# EAGLE design nano19 (EAGLE 9.5.1)
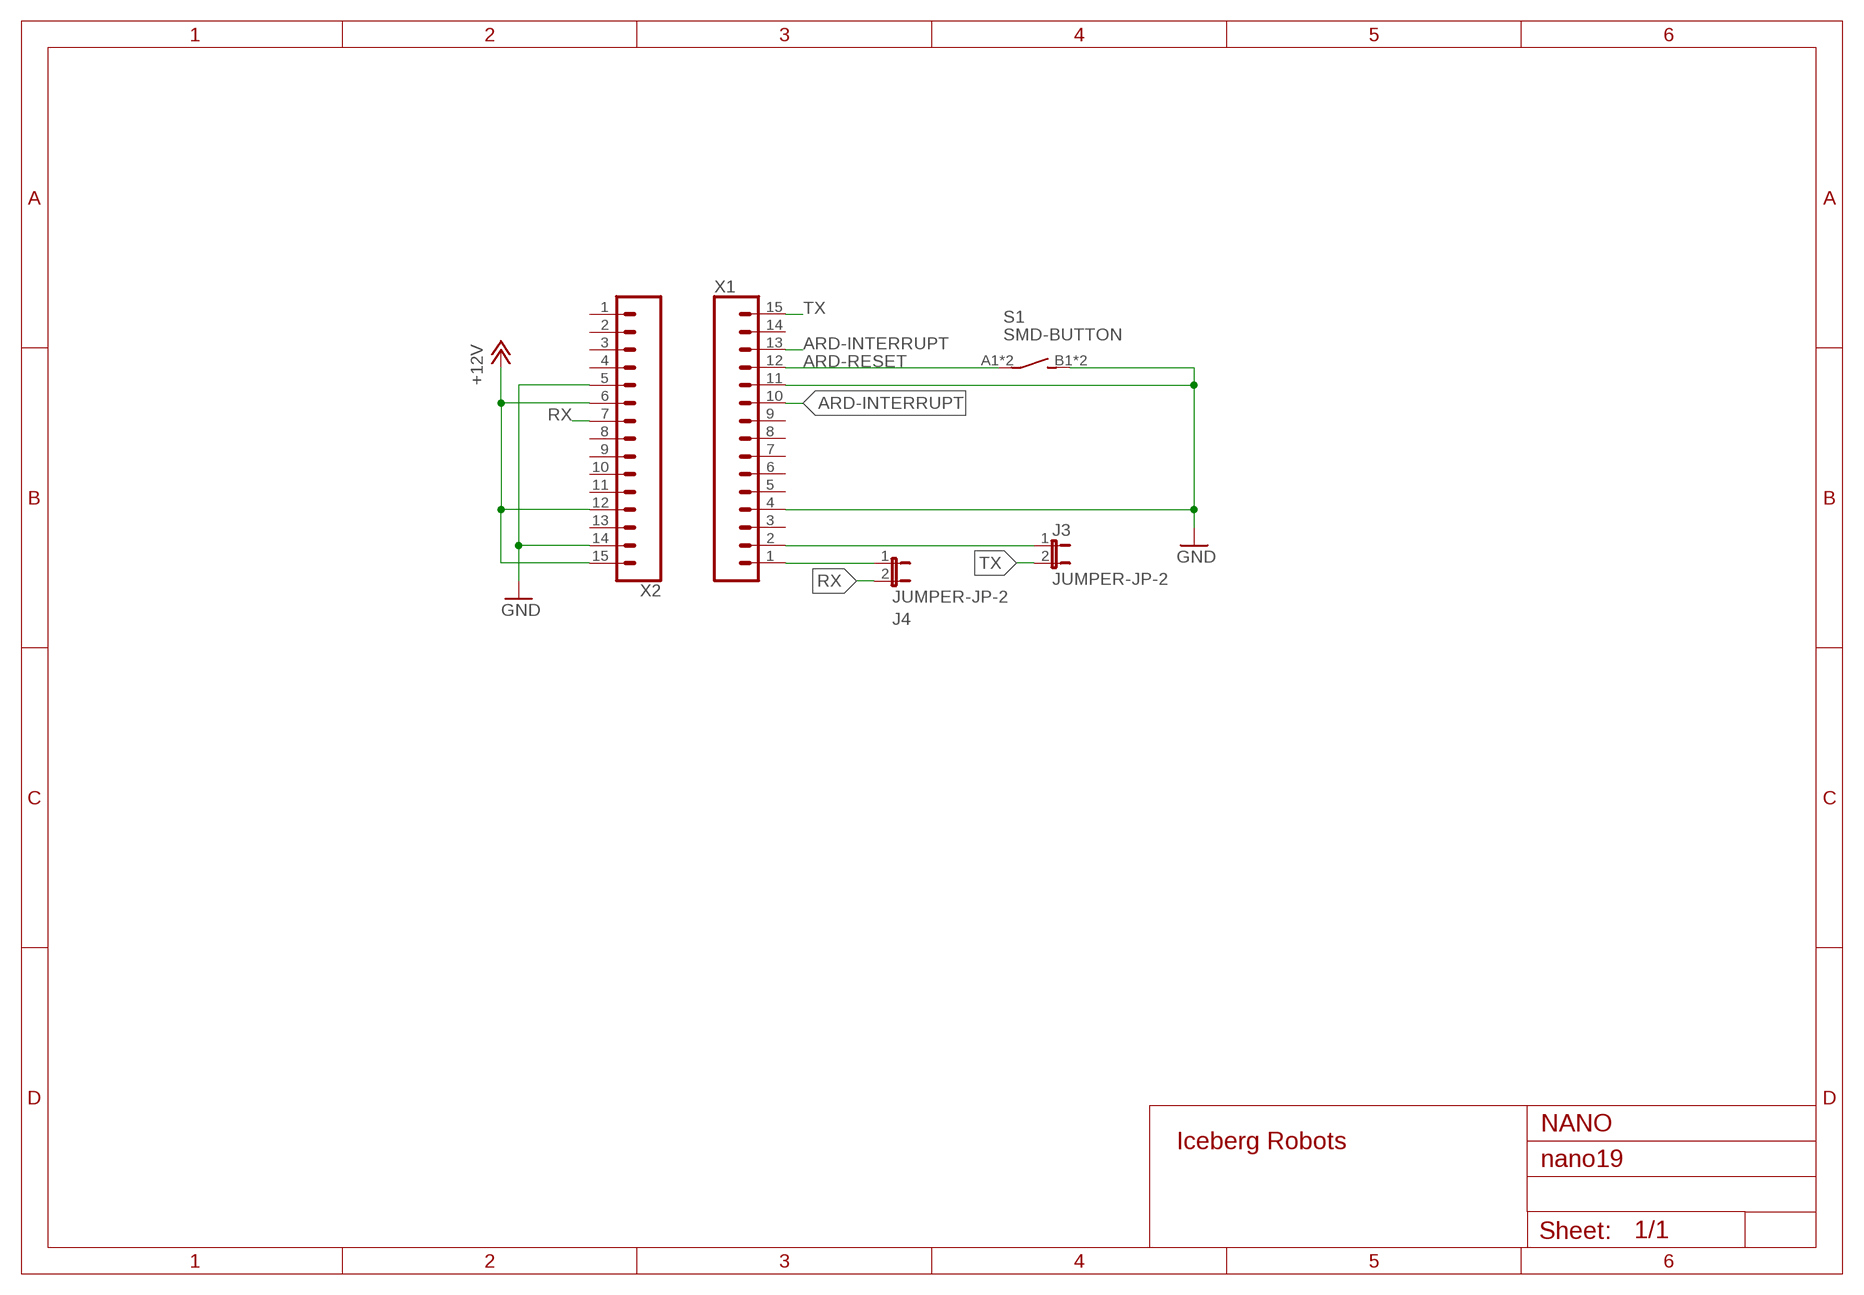
[diagram p0: schematic, sheet 1]

## Parts
J3  JUMPER-JP-2  [JUMPER_JP1]
J4  JUMPER-JP-2  [JUMPER_JP1]
S1  SMD-BUTTON  [SWITCH-6MM-SMD]
X1  CONN_15  [1X15]
X2  CONN_15  [1X15]

## Nets
+12V: X2.6 X2.12 X2.15
ARD-INTERRUPT: X1.10 X1.13
ARD-RESET: S1.A1(P) S1.A2(P) X1.12
GND: S1.B1(S) S1.B2(S) X1.4 X1.11 X2.5 X2.14
N$1: J3.1 X1.2
N$2: J4.1 X1.1
RX: J4.2 X2.7
TX: J3.2 X1.15
Unconnected: X1.3 X1.5 X1.6 X1.7 X1.8 X1.9 X1.14 X2.1 X2.2 X2.3 X2.4 X2.8 X2.9 X2.10 X2.11 X2.13

## Notes on the sheet
- NANO

## Library data of the parts
J3 J4 = iceberg20:JUMPER-JP-2: Datenblatt: Link
S1 = iceberg20:SMD-BUTTON: SMD-Button, 6mm x 6mm Datenblatt: Link <https://www.buerklin.com/medias/sys_master/root/h03/h3f/8877444497438/8877444497438.pdf>; BESTAND: 0; HERSTELLER: Alcoswitch; HERSTELLER-NR: 4-1437565-1 FSM4JSMA; SUPPLIER: Bürklin; SUPPLIER-NR: 12G482
X1 X2 = SparkFun-Connectors:CONN_15: Multi connection point. Often used as Generic Header-pin footprint for 0.1 inch spaced/style header connections On any of the 0.1 inch spaced packages, you can populate with these: Break Away Headers - Straight <https://www.sparkfun.com/products/116> (PRT-00116) Break Away Male Headers - Right Angle <https://www.sparkfun.com/products/553> (PRT-00553) Female Headers <https://www.sparkfun.com/products/115> (PRT-00115) Break Away Headers - Machine Pin <https://www.sparkfun.com/products/117> (PRT-00117) Break Away Female Headers - Swiss Machine Pin <https://www.sparkfun.com/products/743> (PRT-00743) For SCREWTERMINALS and SPRING TERMINALS visit here: Screw Terimnals on SparkFun.com <https://www.sparkfun.com/search/results?term=Screw+Terminals> (5mm/3.5mm/2.54mm spacing) This device is also useful as a general connection point to wire up your design to another part of your project. Our various solder wires solder well into these plated through hole pads. Hook-Up Wire - Assortment (Stranded, 22 AWG) <https://www.sparkfun.com/products/11375> (PRT-11375) Hook-Up Wire - Assortment (Solid Core, 22 AWG) <https://www.sparkfun.com/products/11367> (PRT-11367) View the entire wire category on our website here <https://www.sparkfun.com/categories/141> Special notes: Molex polarized connector foot print use with SKU : PRT-08231 with associated crimp pins and housings. 1MM SMD Version SKU: PRT-10208 NOTES ON THE VARIANTS LOCK and LOCK_LONGPADS... This footprint was designed to help hold the alignment of a through-hole component (i.e. 6-pin header) while soldering it into place. You may notice that each hole has been shifted either up or down by 0.005 of an inch from it's more standard position (which is a perfectly straight line). This slight alteration caused the pins (the squares in the middle) to touch the edges of the holes. Because they are alternating, it causes a "brace" to hold the component in place. 0.005 has proven to be the perfect amount of "off-center" position when using our standard breakaway headers. Although looks a little odd when you look at the bare footprint, once you have a header in there, the alteration is very hard to notice. Also,if you push a header all the way into place, it is covered up entirely on the bottom side.

## Board
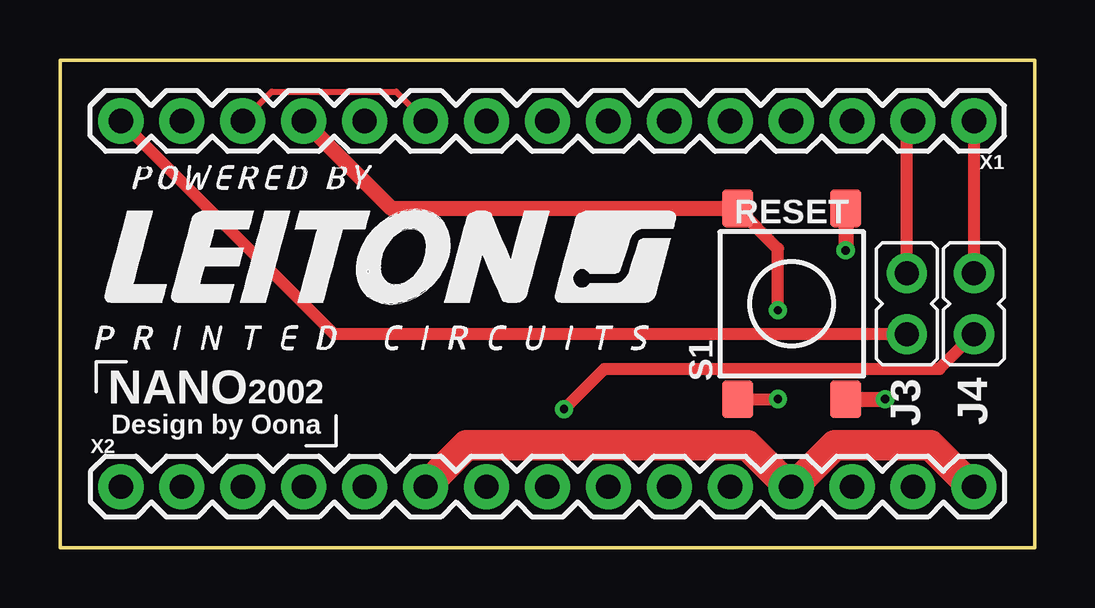
[diagram p1: board, top side]
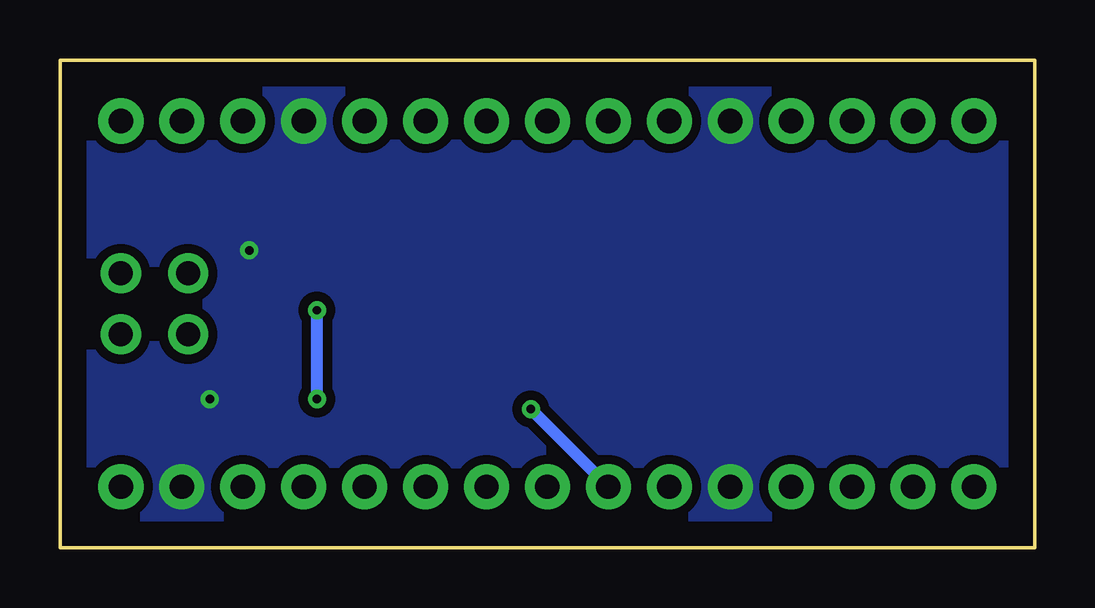
[diagram p2: board, bottom side, seen from below]

Size 40.64 x 20.32 mm. Coordinates in mm from the lower left corner, seen from the top.
Outline: 0,0 0,20.32 40.64,20.32 40.64,0 0,0
Copper layers (1*16): Top 0.035mm / dielectric 0.15mm / Bottom 0.035mm
Design rules "default": minimum track width 6mil, minimum drill 0.35mm, track to track 6mil, track to pad 6mil, pad to pad 6mil, via to via 6mil, smd to smd 6mil, copper to edge 40mil, drill to drill 6mil, minimum pad ring 10mil, minimum via ring 8mil, stop-mask expansion 4mil, vias tented up to drill 0mil, thermal gap 10mil

### Footprints (pad centres in the part's own frame; a part is rotated, then mirrored left to right if it is on the bottom)
JUMPER_JP1 = drill 1 pad 1.676: 1 0,-1.27; 2 0,1.27
SWITCH-6MM-SMD = smd 1.55 x 1.3: A1 -3.975,-2.25; A2 3.975,-2.25; B1 -3.975,2.25; B2 3.975,2.25
1X15 = drill 1.016 pad 1.88: 1 0,0; 2 2.54,0; 3 5.08,0; 4 7.62,0; 5 10.16,0; 6 12.7,0; 7 15.24,0; 8 17.78,0; 9 20.32,0; 10 22.86,0; 11 25.4,0; 12 27.94,0; 13 30.48,0; 14 33.02,0; 15 35.56,0

### Placement (x,y rotation side)
J3  35.3,10.16 180 top
J4  38.1,10.16 180 top
S1  30.5,10.16 270 top
X1  38.1,17.78 180 top
X2  2.54,2.54 0 top

### Tracks (layer width: path | path; a pad name or v marks a point on that pad's centre or on a via)
+12V
  Top 1.27: X2.15 38,2.54 36.27,4.27 32.3,4.27 30.58,2.54 X2.12 30.38,2.54 28.66,4.27 16.95,4.27 15.24,2.56 X2.6
ARD-INTERRUPT
  Top 0.254: X1.10 14.02,19 8.83,19 7.62,17.79 X1.13
ARD-RESET  (via drill 0.35)
  Top 0.508: S1.A2 v29.92,6.18 v29.93,6.19 | v29.93,9.89 29.93,12.46 S1.A1 | S1.A1
  Top 0.635: X1.12 13.8,14.13 S1.A1
  Bottom 0.508: v29.93,6.19 v29.93,9.89
GND  (via drill 0.35)
  Top 0.635: S1.B1 v32.75,12.39 | S1.B2 v34.39,6.18 v34.4,6.19
  pour Bottom (isolate 0.381, no thermals): 40.64,20.32 40.64,0 0,0 0,20.32
N$1
  Top 0.508: J3.1 35.3,17.52 X1.2
N$2
  Top 0.508: X1.1 J4.1
RX  (via drill 0.35)
  Top 0.508: v21.01,5.77 22.69,7.45 36.66,7.45 J4.2
  Bottom 0.508: X2.7 v21.01,5.77
TX
  Top 0.508: X1.15 11.43,8.89 J3.2

### Text on the board
tNames: RESET | NANO | 2002 | Design by Oona